# EAGLE design rev_4 (EAGLE 5.10)

## Sheet 1 of 2
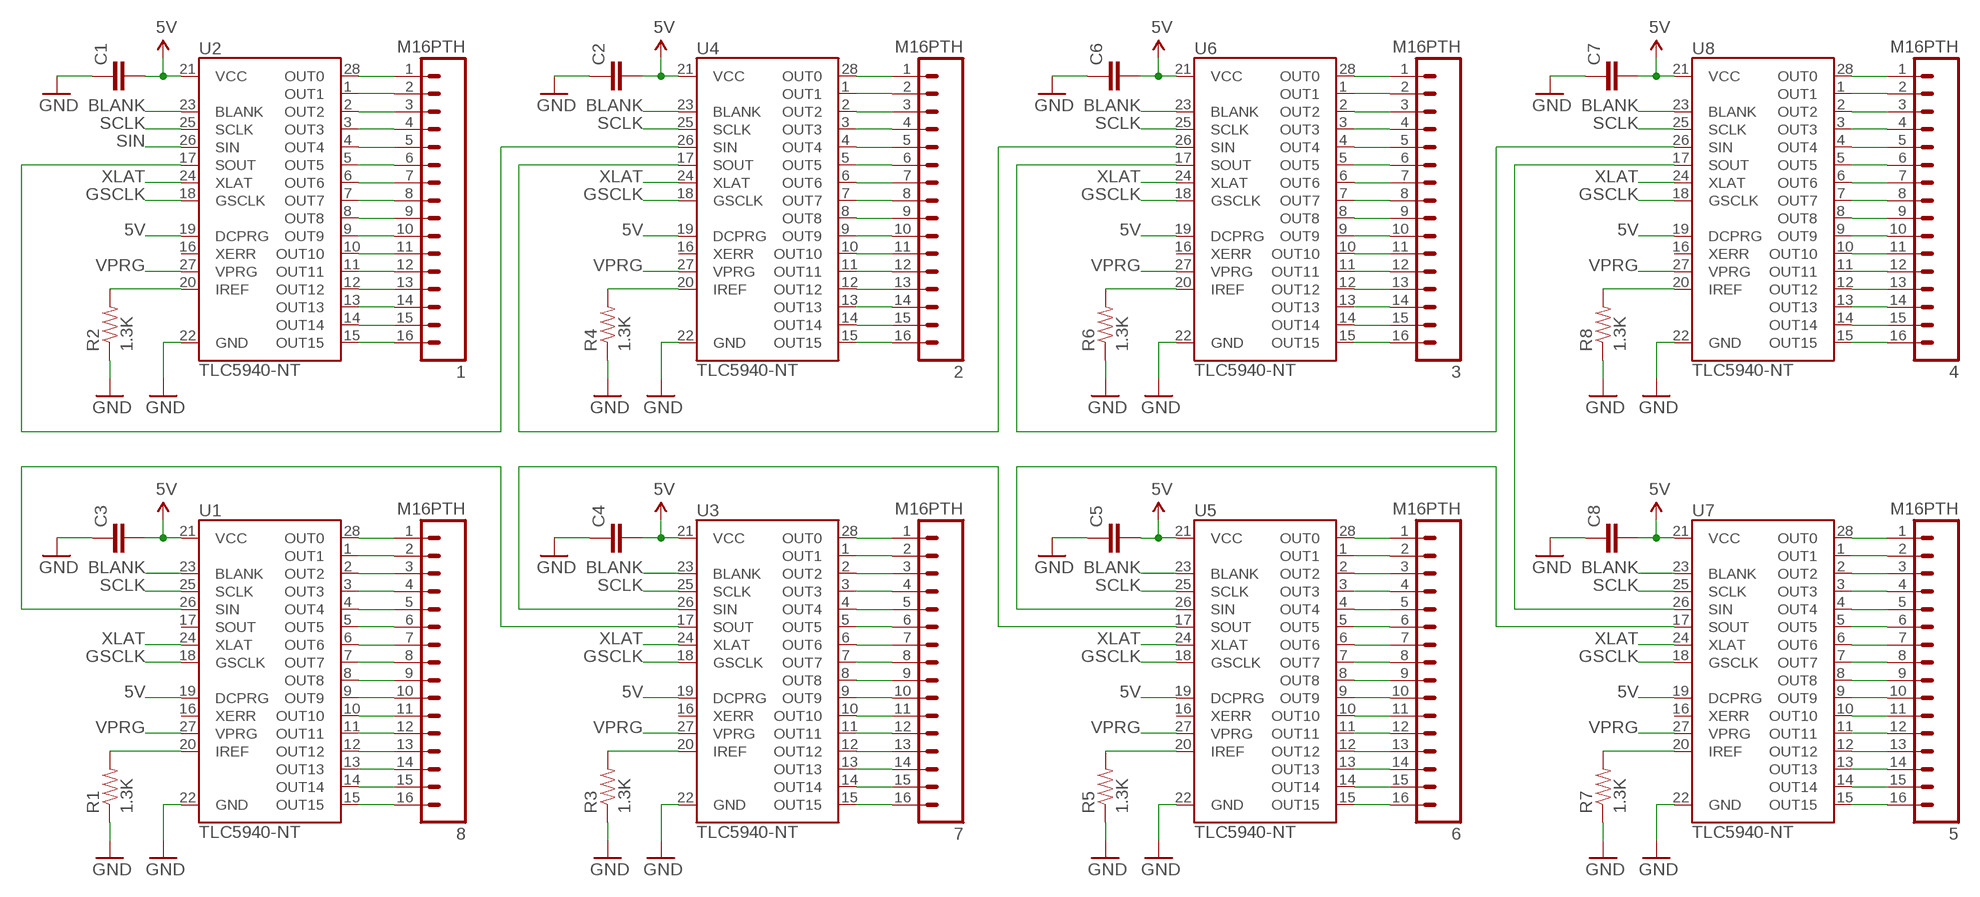
[diagram p0: schematic, sheet 1]

### Parts
1  M16PTH  [1X16]
2  M16PTH  [1X16]
3  M16PTH  [1X16]
4  M16PTH  [1X16]
5  M16PTH  [1X16]
6  M16PTH  [1X16]
7  M16PTH  [1X16]
8  M16PTH  [1X16]
C1  CAPPTH  [CAP-PTH-SMALL]
C2  CAPPTH  [CAP-PTH-SMALL]
C3  CAPPTH  [CAP-PTH-SMALL]
C4  CAPPTH  [CAP-PTH-SMALL]
C5  CAPPTH  [CAP-PTH-SMALL]
C6  CAPPTH  [CAP-PTH-SMALL]
C7  CAPPTH  [CAP-PTH-SMALL]
C8  CAPPTH  [CAP-PTH-SMALL]
R1  1.3K  RESISTORPTH-1/6W  [1/6W-RES]
R2  1.3K  RESISTORPTH-1/6W  [1/6W-RES]
R3  1.3K  RESISTORPTH-1/6W  [1/6W-RES]
R4  1.3K  RESISTORPTH-1/6W  [1/6W-RES]
R5  1.3K  RESISTORPTH-1/6W  [1/6W-RES]
R6  1.3K  RESISTORPTH-1/6W  [1/6W-RES]
R7  1.3K  RESISTORPTH-1/6W  [1/6W-RES]
R8  1.3K  RESISTORPTH-1/6W  [1/6W-RES]
U1  TLC5940-NT  [DIL28-3]
U2  TLC5940-NT  [DIL28-3]
U3  TLC5940-NT  [DIL28-3]
U4  TLC5940-NT  [DIL28-3]
U5  TLC5940-NT  [DIL28-3]
U6  TLC5940-NT  [DIL28-3]
U7  TLC5940-NT  [DIL28-3]
U8  TLC5940-NT  [DIL28-3]

### Nets
5V: C1.2 C2.2 C3.2 C4.2 C5.2 C6.2 C7.2 C8.2 U1.19(DCPRG) U1.21(VCC) U2.19(DCPRG) U2.21(VCC) U3.19(DCPRG) U3.21(VCC) U4.19(DCPRG) U4.21(VCC) U5.19(DCPRG) U5.21(VCC) U6.19(DCPRG) U6.21(VCC) U7.19(DCPRG) U7.21(VCC) U8.19(DCPRG) U8.21(VCC)
BLANK: U1.23(BLANK) U2.23(BLANK) U3.23(BLANK) U4.23(BLANK) U5.23(BLANK) U6.23(BLANK) U7.23(BLANK) U8.23(BLANK)
GND: C1.1 C2.1 C3.1 C4.1 C5.1 C6.1 C7.1 C8.1 R1.1 R2.1 R3.1 R4.1 R5.1 R6.1 R7.1 R8.1 U1.22(GND) U2.22(GND) U3.22(GND) U4.22(GND) U5.22(GND) U6.22(GND) U7.22(GND) U8.22(GND)
GSCLK: U1.18(GSCLK) U2.18(GSCLK) U3.18(GSCLK) U4.18(GSCLK) U5.18(GSCLK) U6.18(GSCLK) U7.18(GSCLK) U8.18(GSCLK)
N$1: 8.1 U1.28(OUT0)
N$2: 8.2 U1.1(OUT1)
N$3: 8.3 U1.2(OUT2)
N$4: 8.4 U1.3(OUT3)
N$5: 8.5 U1.4(OUT4)
N$6: 8.6 U1.5(OUT5)
N$7: 8.7 U1.6(OUT6)
N$8: 8.8 U1.7(OUT7)
N$9: 8.9 U1.8(OUT8)
N$10: 8.10 U1.9(OUT9)
N$11: 8.11 U1.10(OUT10)
N$12: 8.12 U1.11(OUT11)
N$13: 8.13 U1.12(OUT12)
N$14: 8.14 U1.13(OUT13)
N$15: 8.15 U1.14(OUT14)
N$16: 8.16 U1.15(OUT15)
N$17: R1.2 U1.20(IREF)
N$18: R2.2 U2.20(IREF)
N$19: 1.1 U2.28(OUT0)
N$20: 1.2 U2.1(OUT1)
N$23: 1.3 U2.2(OUT2)
N$24: 1.4 U2.3(OUT3)
N$25: 1.5 U2.4(OUT4)
N$26: 1.6 U2.5(OUT5)
N$27: 1.7 U2.6(OUT6)
N$28: 1.8 U2.7(OUT7)
N$29: 1.9 U2.8(OUT8)
N$30: 1.10 U2.9(OUT9)
N$31: 1.11 U2.10(OUT10)
N$32: 1.12 U2.11(OUT11)
N$33: 1.13 U2.12(OUT12)
N$34: 1.14 U2.13(OUT13)
N$35: 1.15 U2.14(OUT14)
N$36: 1.16 U2.15(OUT15)
N$37: U2.17(SOUT) U4.26(SIN)
N$39: R3.2 U3.20(IREF)
N$40: 7.1 U3.28(OUT0)
N$41: 7.2 U3.1(OUT1)
N$42: 7.3 U3.2(OUT2)
N$43: 7.4 U3.3(OUT3)
N$44: 7.5 U3.4(OUT4)
N$45: 7.6 U3.5(OUT5)
N$46: 7.7 U3.6(OUT6)
N$47: 7.8 U3.7(OUT7)
N$48: 7.9 U3.8(OUT8)
N$49: 7.10 U3.9(OUT9)
N$50: 7.11 U3.10(OUT10)
N$51: 7.12 U3.11(OUT11)
N$52: 7.13 U3.12(OUT12)
N$53: 7.14 U3.13(OUT13)
N$54: 7.15 U3.14(OUT14)
N$55: 7.16 U3.15(OUT15)
N$56: U1.26(SIN) U3.17(SOUT)
N$58: R4.2 U4.20(IREF)
N$59: 2.1 U4.28(OUT0)
N$60: 2.2 U4.1(OUT1)
N$61: 2.3 U4.2(OUT2)
N$62: 2.4 U4.3(OUT3)
N$63: 2.5 U4.4(OUT4)
N$64: 2.6 U4.5(OUT5)
N$65: 2.7 U4.6(OUT6)
N$66: 2.8 U4.7(OUT7)
N$67: 2.9 U4.8(OUT8)
N$68: 2.10 U4.9(OUT9)
N$69: 2.11 U4.10(OUT10)
N$70: 2.12 U4.11(OUT11)
N$71: 2.13 U4.12(OUT12)
N$72: 2.14 U4.13(OUT13)
N$73: 2.15 U4.14(OUT14)
N$74: 2.16 U4.15(OUT15)
N$75: U4.17(SOUT) U6.26(SIN)
N$77: R5.2 U5.20(IREF)
N$78: 6.1 U5.28(OUT0)
N$79: 6.2 U5.1(OUT1)
N$80: 6.3 U5.2(OUT2)
N$81: 6.4 U5.3(OUT3)
N$82: 6.5 U5.4(OUT4)
N$83: 6.6 U5.5(OUT5)
N$84: 6.7 U5.6(OUT6)
N$85: 6.8 U5.7(OUT7)
N$86: 6.9 U5.8(OUT8)
N$87: 6.10 U5.9(OUT9)
N$88: 6.11 U5.10(OUT10)
N$89: 6.12 U5.11(OUT11)
N$90: 6.13 U5.12(OUT12)
N$91: 6.14 U5.13(OUT13)
N$92: 6.15 U5.14(OUT14)
N$93: 6.16 U5.15(OUT15)
N$94: U3.26(SIN) U5.17(SOUT)
N$96: R6.2 U6.20(IREF)
N$97: 3.1 U6.28(OUT0)
N$98: 3.2 U6.1(OUT1)
N$99: 3.3 U6.2(OUT2)
N$100: 3.4 U6.3(OUT3)
N$101: 3.5 U6.4(OUT4)
N$102: 3.6 U6.5(OUT5)
N$103: 3.7 U6.6(OUT6)
N$104: 3.8 U6.7(OUT7)
N$105: 3.9 U6.8(OUT8)
N$106: 3.10 U6.9(OUT9)
N$107: 3.11 U6.10(OUT10)
N$108: 3.12 U6.11(OUT11)
N$109: 3.13 U6.12(OUT12)
N$110: 3.14 U6.13(OUT13)
N$111: 3.15 U6.14(OUT14)
N$112: 3.16 U6.15(OUT15)
N$113: U6.17(SOUT) U8.26(SIN)
N$115: R7.2 U7.20(IREF)
N$116: 5.1 U7.28(OUT0)
N$117: 5.2 U7.1(OUT1)
N$118: 5.3 U7.2(OUT2)
N$119: 5.4 U7.3(OUT3)
N$120: 5.5 U7.4(OUT4)
N$121: 5.6 U7.5(OUT5)
N$122: 5.7 U7.6(OUT6)
N$123: 5.8 U7.7(OUT7)
N$124: 5.9 U7.8(OUT8)
N$125: 5.10 U7.9(OUT9)
N$126: 5.11 U7.10(OUT10)
N$127: 5.12 U7.11(OUT11)
N$128: 5.13 U7.12(OUT12)
N$129: 5.14 U7.13(OUT13)
N$130: 5.15 U7.14(OUT14)
N$131: 5.16 U7.15(OUT15)
N$132: U5.26(SIN) U7.17(SOUT)
N$134: R8.2 U8.20(IREF)
N$135: 4.1 U8.28(OUT0)
N$136: 4.2 U8.1(OUT1)
N$137: 4.3 U8.2(OUT2)
N$138: 4.4 U8.3(OUT3)
N$139: 4.5 U8.4(OUT4)
N$140: 4.6 U8.5(OUT5)
N$141: 4.7 U8.6(OUT6)
N$142: 4.8 U8.7(OUT7)
N$143: 4.9 U8.8(OUT8)
N$144: 4.10 U8.9(OUT9)
N$145: 4.11 U8.10(OUT10)
N$146: 4.12 U8.11(OUT11)
N$147: 4.13 U8.12(OUT12)
N$148: 4.14 U8.13(OUT13)
N$149: 4.15 U8.14(OUT14)
N$150: 4.16 U8.15(OUT15)
N$151: U7.26(SIN) U8.17(SOUT)
SCLK: U1.25(SCLK) U2.25(SCLK) U3.25(SCLK) U4.25(SCLK) U5.25(SCLK) U6.25(SCLK) U7.25(SCLK) U8.25(SCLK)
SIN: U2.26(SIN)
VPRG: U1.27(VPRG) U2.27(VPRG) U3.27(VPRG) U4.27(VPRG) U5.27(VPRG) U6.27(VPRG) U7.27(VPRG) U8.27(VPRG)
XLAT: U1.24(XLAT) U2.24(XLAT) U3.24(XLAT) U4.24(XLAT) U5.24(XLAT) U6.24(XLAT) U7.24(XLAT) U8.24(XLAT)
Unconnected: U1.16(XERR) U1.17(SOUT) U2.16(XERR) U3.16(XERR) U4.16(XERR) U5.16(XERR) U6.16(XERR) U7.16(XERR) U8.16(XERR)

## Sheet 2 of 2
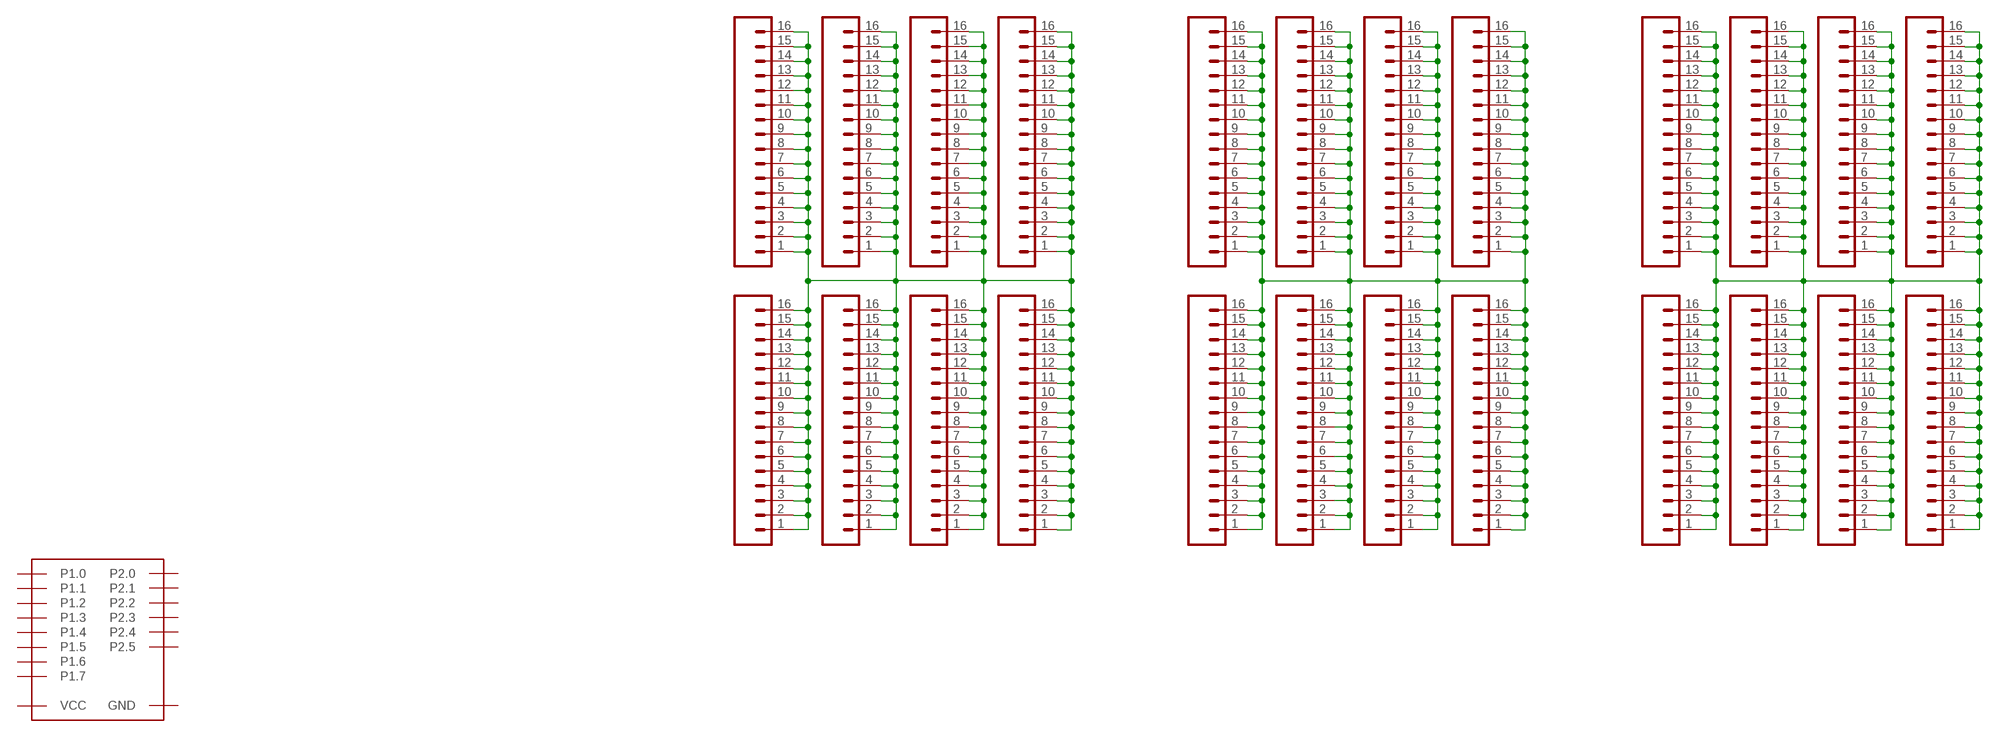
[diagram p1: schematic, sheet 2]

### Parts
JP1  M16PTH  [1X16]
JP2  M16PTH  [1X16]
JP3  M16PTH  [1X16]
JP4  M16PTH  [1X16]
JP5  M16PTH  [1X16]
JP6  M16PTH  [1X16]
JP7  M16PTH  [1X16]
JP8  M16PTH  [1X16]
JP9  M16PTH  [1X16]
JP10  M16PTH  [1X16]
JP11  M16PTH  [1X16]
JP12  M16PTH  [1X16]
JP13  M16PTH  [1X16]
JP14  M16PTH  [1X16]
JP15  M16PTH  [1X16]
JP16  M16PTH  [1X16]
JP17  M16PTH  [1X16]
JP18  M16PTH  [1X16]
JP19  M16PTH  [1X16]
JP20  M16PTH  [1X16]
JP21  M16PTH  [1X16]
JP22  M16PTH  [1X16]
JP23  M16PTH  [1X16]
JP24  M16PTH  [1X16]
U$9  TI_LAUNCHPAD  [TI_LAUNCHPAD]

### Nets
N$21: JP2.1 JP2.2 JP2.3 JP2.4 JP2.5 JP2.6 JP2.7 JP2.8 JP2.9 JP2.10 JP2.11 JP2.12 JP2.13 JP2.14 JP2.15 JP2.16 JP5.1 JP5.2 JP5.3 JP5.4 JP5.5 JP5.6 JP5.7 JP5.8 JP5.9 JP5.10 JP5.11 JP5.12 JP5.13 JP5.14 JP5.15 JP5.16 JP8.1 JP8.2 JP8.3 JP8.4 JP8.5 JP8.6 JP8.7 JP8.8 JP8.9 JP8.10 JP8.11 JP8.12 JP8.13 JP8.14 JP8.15 JP8.16 JP11.1 JP11.2 JP11.3 JP11.4 JP11.5 JP11.6 JP11.7 JP11.8 JP11.9 JP11.10 JP11.11 JP11.12 JP11.13 JP11.14 JP11.15 JP11.16 JP14.1 JP14.2 JP14.3 JP14.4 JP14.5 JP14.6 JP14.7 JP14.8 JP14.9 JP14.10 JP14.11 JP14.12 JP14.13 JP14.14 JP14.15 JP14.16 JP17.1 JP17.2 JP17.3 JP17.4 JP17.5 JP17.6 JP17.7 JP17.8 JP17.9 JP17.10 JP17.11 JP17.12 JP17.13 JP17.14 JP17.15 JP17.16 JP19.1 JP19.2 JP19.3 JP19.4 JP19.5 JP19.6 JP19.7 JP19.8 JP19.9 JP19.10 JP19.11 JP19.12 JP19.13 JP19.14 JP19.15 JP19.16 JP22.1 JP22.2 JP22.3 JP22.4 JP22.5 JP22.6 JP22.7 JP22.8 JP22.9 JP22.10 JP22.11 JP22.12 JP22.13 JP22.14 JP22.15 JP22.16
N$22: JP1.1 JP1.2 JP1.3 JP1.4 JP1.5 JP1.6 JP1.7 JP1.8 JP1.9 JP1.10 JP1.11 JP1.12 JP1.13 JP1.14 JP1.15 JP1.16 JP4.1 JP4.2 JP4.3 JP4.4 JP4.5 JP4.6 JP4.7 JP4.8 JP4.9 JP4.10 JP4.11 JP4.12 JP4.13 JP4.14 JP4.15 JP4.16 JP7.1 JP7.2 JP7.3 JP7.4 JP7.5 JP7.6 JP7.7 JP7.8 JP7.9 JP7.10 JP7.11 JP7.12 JP7.13 JP7.14 JP7.15 JP7.16 JP10.1 JP10.2 JP10.3 JP10.4 JP10.5 JP10.6 JP10.7 JP10.8 JP10.9 JP10.10 JP10.11 JP10.12 JP10.13 JP10.14 JP10.15 JP10.16 JP13.1 JP13.2 JP13.3 JP13.4 JP13.5 JP13.6 JP13.7 JP13.8 JP13.9 JP13.10 JP13.11 JP13.12 JP13.13 JP13.14 JP13.15 JP13.16 JP16.1 JP16.2 JP16.3 JP16.4 JP16.5 JP16.6 JP16.7 JP16.8 JP16.9 JP16.10 JP16.11 JP16.12 JP16.13 JP16.14 JP16.15 JP16.16 JP20.1 JP20.2 JP20.3 JP20.4 JP20.5 JP20.6 JP20.7 JP20.8 JP20.9 JP20.10 JP20.11 JP20.12 JP20.13 JP20.14 JP20.15 JP20.16 JP23.1 JP23.2 JP23.3 JP23.4 JP23.5 JP23.6 JP23.7 JP23.8 JP23.9 JP23.10 JP23.11 JP23.12 JP23.13 JP23.14 JP23.15 JP23.16
N$76: JP3.1 JP3.2 JP3.3 JP3.4 JP3.5 JP3.6 JP3.7 JP3.8 JP3.9 JP3.10 JP3.11 JP3.12 JP3.13 JP3.14 JP3.15 JP3.16 JP6.1 JP6.2 JP6.3 JP6.4 JP6.5 JP6.6 JP6.7 JP6.8 JP6.9 JP6.10 JP6.11 JP6.12 JP6.13 JP6.14 JP6.15 JP6.16 JP9.1 JP9.2 JP9.3 JP9.4 JP9.5 JP9.6 JP9.7 JP9.8 JP9.9 JP9.10 JP9.11 JP9.12 JP9.13 JP9.14 JP9.15 JP9.16 JP12.1 JP12.2 JP12.3 JP12.4 JP12.5 JP12.6 JP12.7 JP12.8 JP12.9 JP12.10 JP12.11 JP12.12 JP12.13 JP12.14 JP12.15 JP12.16 JP15.1 JP15.2 JP15.3 JP15.4 JP15.5 JP15.6 JP15.7 JP15.8 JP15.9 JP15.10 JP15.11 JP15.12 JP15.13 JP15.14 JP15.15 JP15.16 JP18.1 JP18.2 JP18.3 JP18.4 JP18.5 JP18.6 JP18.7 JP18.8 JP18.9 JP18.10 JP18.11 JP18.12 JP18.13 JP18.14 JP18.15 JP18.16 JP21.1 JP21.2 JP21.3 JP21.4 JP21.5 JP21.6 JP21.7 JP21.8 JP21.9 JP21.10 JP21.11 JP21.12 JP21.13 JP21.14 JP21.15 JP21.16 JP24.1 JP24.2 JP24.3 JP24.4 JP24.5 JP24.6 JP24.7 JP24.8 JP24.9 JP24.10 JP24.11 JP24.12 JP24.13 JP24.14 JP24.15 JP24.16
Unconnected: U$9.GND U$9.P1.0 U$9.P1.1 U$9.P1.2 U$9.P1.3 U$9.P1.4 U$9.P1.5 U$9.P1.6 U$9.P1.7 U$9.P2.0 U$9.P2.1 U$9.P2.2 U$9.P2.3 U$9.P2.4 U$9.P2.5 U$9.VCC

## Library data of the parts
1-8 JP1-JP24 = SparkFun:M16
C1-C8 = SparkFun:CAP: Capacitor Standard 0603 ceramic capacitor, and 0.1" leaded capacitor.
R1-R8 = SparkFun:RESISTOR: Resistor Basic schematic elements and footprints for 0603, 1206, and PTH resistors.
U1-U8 = SparkFun:TLC5940: TI TLC5940 16-channel LED Driver with Dot Correction and Grayscale PWM Control The TLC5940 is a 16-channel, constant-current sink LED driver. Each channel has an individually adjustable 4096-step grayscale PWM brightness control and a 64-step, constant-current sink (dot correction). The dot correction adjusts the brightness variations between LED channels and other LED drivers. The dot correction data is stored in an integrated EEPROM. Both grayscale control and dot correction are accessible via a serial interface. A single external resistor sets the maximum current value of all 16 channels. Packages: 28-pin HTSSOP 32-pin 5x5mm QFN 28-pin DIP
U$9 = launchpad_comp:TI_LAUNCHPAD

## Board
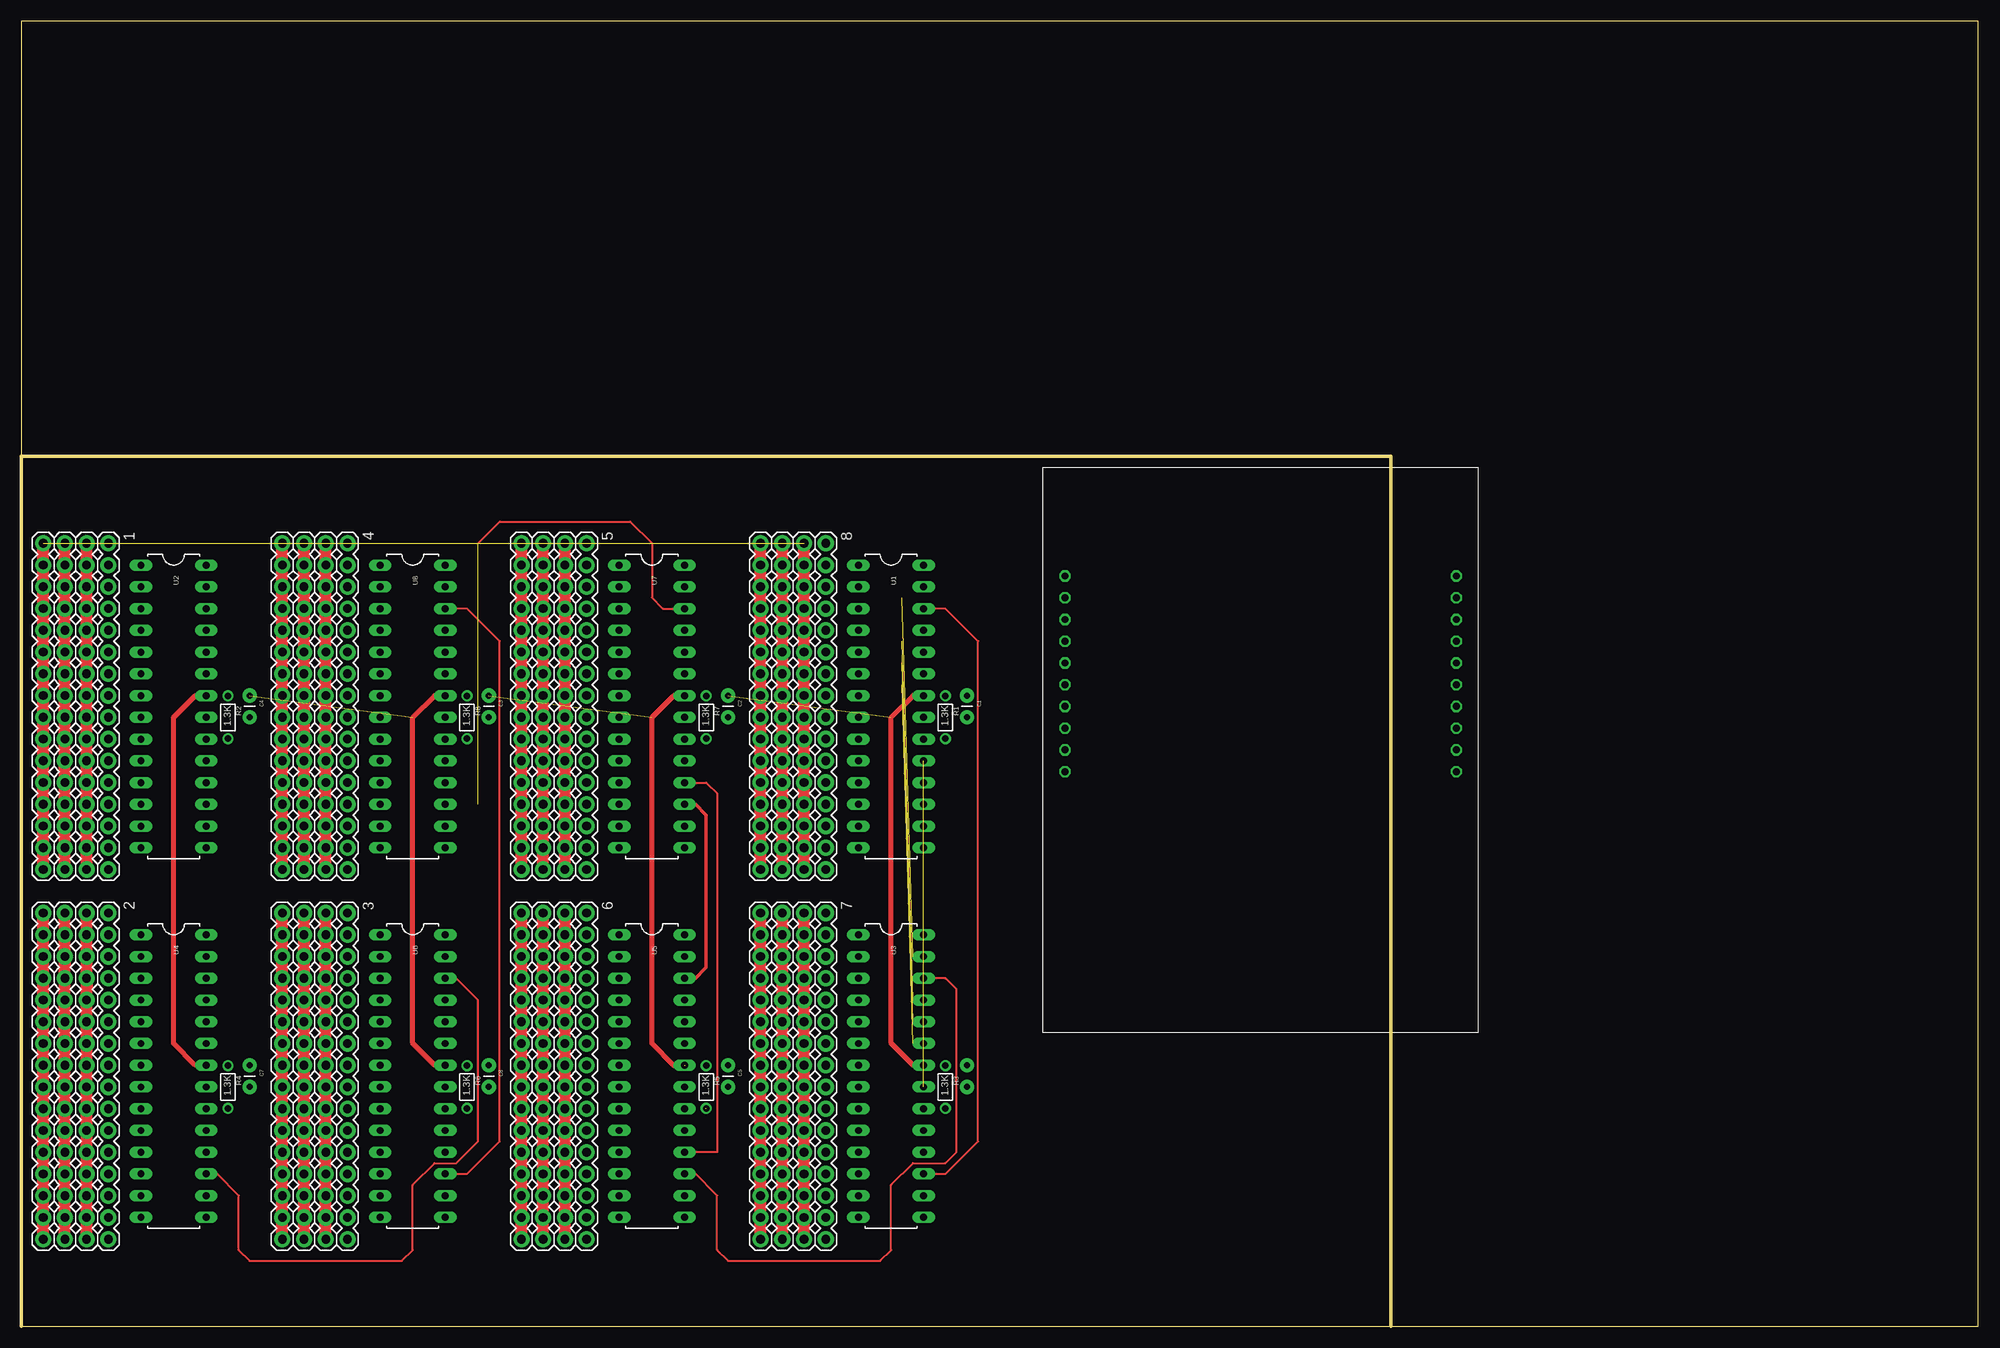
[diagram p2: board, top side]
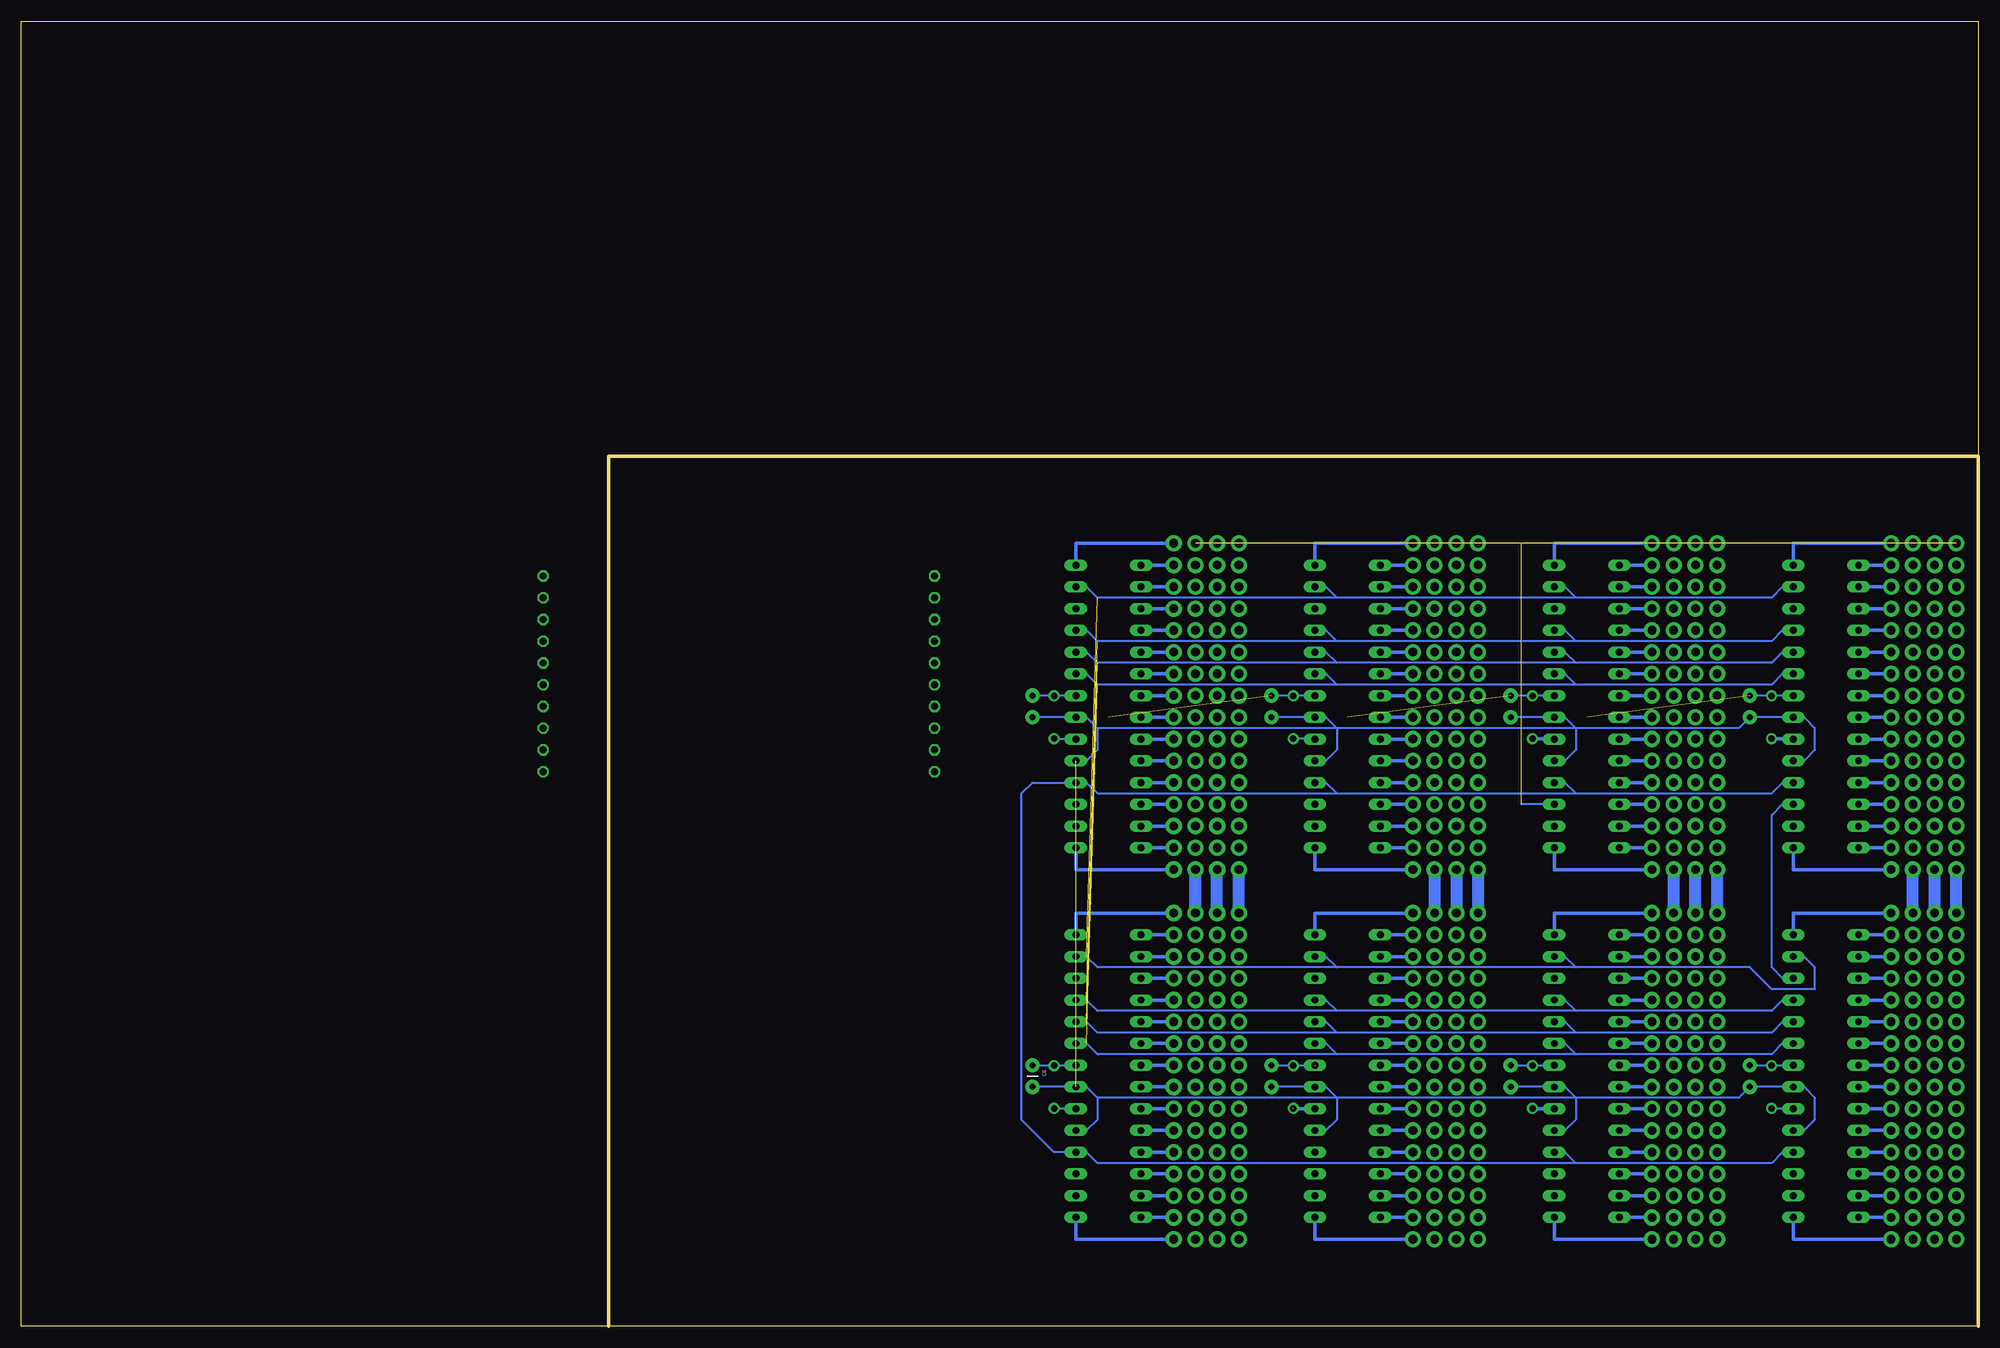
[diagram p3: board, bottom side, seen from below]

Size 228.6 x 152.4 mm. Coordinates in mm from the lower left corner, seen from the top.
Outline: 160.02,0 0,0 0,101.6
Outline: 160.02,0 228.6,0 228.6,152.4 0,152.4 0,101.6
Outline: 0,101.6 160.02,101.6 160.02,0
Copper layers (1*16): Top 0.0356mm / dielectric 1.5011mm / Bottom 0.0356mm
Design rules "SilverCircuits": minimum track width 7mil, minimum drill 14mil, track to track 7mil, track to pad 7mil, pad to pad 7mil, via to via 7mil, smd to smd 0mil, copper to edge 20mil, drill to drill 8mil, minimum pad ring 10mil, minimum via ring 8mil, stop-mask expansion 4mil, vias tented up to drill 0mil, thermal gap 10mil

### Footprints (pad centres in the part's own frame; a part is rotated, then mirrored left to right if it is on the bottom)
1X16 = drill 1.016 pad 1.88 round: 1 0,0; 2 2.54,0; 3 5.08,0; 4 7.62,0; 5 10.16,0; 6 12.7,0; 7 15.24,0; 8 17.78,0; 9 20.32,0; 10 22.86,0; 11 25.4,0; 12 27.94,0; 13 30.48,0; 14 33.02,0; 15 35.56,0; 16 38.1,0
CAP-PTH-SMALL = drill 0.7 pad 1.651 round: 1 0,0; 2 2.54,0
1/6W-RES = drill 0.762 round: 1 -2.5,0; 2 2.5,0
DIL28-3 = drill 0.813 long: 1 -16.51,-3.81; 2 -13.97,-3.81; 3 -11.43,-3.81; 4 -8.89,-3.81; 5 -6.35,-3.81; 6 -3.81,-3.81; 7 -1.27,-3.81; 8 1.27,-3.81; 9 3.81,-3.81; 10 6.35,-3.81; 11 8.89,-3.81; 12 11.43,-3.81; 13 13.97,-3.81; 14 16.51,-3.81; 15 16.51,3.81; 16 13.97,3.81; 17 11.43,3.81; 18 8.89,3.81; 19 6.35,3.81; 20 3.81,3.81; 21 1.27,3.81; 22 -1.27,3.81; 23 -3.81,3.81; 24 -6.35,3.81; 25 -8.89,3.81; 26 -11.43,3.81; 27 -13.97,3.81; 28 -16.51,3.81
TI_LAUNCHPAD = drill 0.8 octagon: GND 48.26,35.56; P1.0 2.54,33.02; P1.1 2.54,30.48; P1.2 2.54,27.94; P1.3 2.54,25.4; P1.4 2.54,22.86; P1.5 2.54,20.32; P1.6 48.26,20.32; P1.7 48.26,22.86; P2.0 2.54,17.78; P2.1 2.54,15.24; P2.2 2.54,12.7; P2.3 48.26,12.7; P2.4 48.26,15.24; P2.5 48.26,17.78; RST 48.26,25.4; TEST 48.26,27.94; VCC 2.54,35.56; XIN 48.26,33.02; XOUT 48.26,30.48

### Placement (x,y rotation side)
1  10.16,91.44 270 top
2  10.16,48.26 270 top
3  38.1,48.26 270 top
4  38.1,91.44 270 top
5  66.04,91.44 270 top
6  66.04,48.26 270 top
7  93.98,48.26 270 top
8  93.98,91.44 270 top
C1  110.49,73.66 270 top
C2  82.55,73.66 270 top
C3  54.61,73.66 270 top
C4  26.67,73.66 270 top
C5  82.55,30.48 270 top
C6  110.49,30.48 270 bottom
C7  26.67,30.48 270 top
C8  54.61,30.48 270 top
JP1  7.62,91.44 270 top
JP2  5.08,91.44 270 top
JP3  2.54,91.44 270 top
JP4  7.62,48.26 270 top
JP5  5.08,48.26 270 top
JP6  2.54,48.26 270 top
JP7  35.56,91.44 270 top
JP8  33.02,91.44 270 top
JP9  30.48,91.44 270 top
JP10  35.56,48.26 270 top
JP11  33.02,48.26 270 top
JP12  30.48,48.26 270 top
JP13  63.5,91.44 270 top
JP14  60.96,91.44 270 top
JP15  86.36,48.26 270 top
JP16  91.44,48.26 270 top
JP17  88.9,48.26 270 top
JP18  86.36,91.44 270 top
JP19  88.9,91.44 270 top
JP20  91.44,91.44 270 top
JP21  58.42,48.26 270 top
JP22  60.96,48.26 270 top
JP23  63.5,48.26 270 top
JP24  58.42,91.44 270 top
R1  107.95,71.12 270 top
R2  24.13,71.12 270 top
R3  107.95,27.94 270 top
R4  24.13,27.94 270 top
R5  80.01,27.94 270 top
R6  52.07,27.94 270 top
R7  80.01,71.12 270 top
R8  52.07,71.12 270 top
U1  101.6,72.39 270 top
U2  17.78,72.39 270 top
U3  101.6,29.21 270 top
U4  17.78,29.21 270 top
U5  73.66,29.21 270 top
U6  45.72,29.21 270 top
U7  73.66,72.39 270 top
U8  45.72,72.39 270 top
U$9  170.18,100.33 180 top

### Tracks (layer width: path | path; a pad name or v marks a point on that pad's centre or on a via)
5V  (1 unrouted)
  Bottom 0.254: 46.99,69.85 74.93,69.85 | 74.93,69.85 102.87,69.85 | 102.87,69.85 104.14,71.12 U1.21 C1.2 | 74.93,69.85 76.2,71.12 U7.21 C2.2 | 46.99,69.85 48.26,71.12 U8.21 C3.2 | 46.99,26.67 74.93,26.67 | 74.93,26.67 102.87,26.67 | 102.87,26.67 104.14,27.94 U3.21 C6.2 | 74.93,26.67 76.2,27.94 U5.21 C5.2 | 46.99,26.67 48.26,27.94 U6.21 C8.2 | U6.19 48.26,22.86 46.99,24.13 46.99,26.67 | U5.19 76.2,22.86 74.93,24.13 74.93,26.67 | U3.19 104.14,22.86 102.87,24.13 102.87,26.67 | U1.19 104.14,66.04 102.87,67.31 102.87,69.85 | U7.19 76.2,66.04 74.93,67.31 74.93,69.85 | U8.19 48.26,66.04 46.99,67.31 46.99,69.85 | U2.19 20.32,66.04 19.05,67.31 19.05,69.85 20.32,71.12 U2.21 C4.2 27.94,69.85 46.99,69.85 | 46.99,26.67 27.94,26.67 C7.2 U4.21 20.32,27.94 19.05,26.67 19.05,24.13 20.32,22.86 U4.19
BLANK  (1 unrouted)
  Bottom 0.254: U2.23 22.86,76.2 24.13,74.93 46.99,74.93 | 46.99,74.93 74.93,74.93 | 74.93,74.93 102.87,74.93 104.14,76.2 U1.23 | U7.23 76.2,76.2 74.93,74.93 | U8.23 48.26,76.2 46.99,74.93 | U4.23 22.86,33.02 24.13,31.75 46.99,31.75 | 46.99,31.75 74.93,31.75 | 74.93,31.75 102.87,31.75 104.14,33.02 U3.23 | U5.23 76.2,33.02 74.93,31.75 | U6.23 48.26,33.02 46.99,31.75
GND  (4 unrouted)
  Top 0.61: U4.22 20.32,30.48 17.78,33.02 17.78,71.12 20.32,73.66 U2.22 | U6.22 48.26,30.48 45.72,33.02 45.72,71.12 48.26,73.66 U8.22 | U3.22 104.14,30.48 101.6,33.02 101.6,71.12 104.14,73.66 U1.22 | 77.47,30.44 76.24,30.44 73.66,33.02 73.66,71.12 76.2,73.66 U7.22
  Bottom 0.254: U4.22 21.63,30.44 R4.1 26.63,30.44 C7.1 | U2.22 21.63,73.62 R2.1 26.63,73.62 C4.1 | U8.22 49.57,73.62 R8.1 54.57,73.62 C3.1 | U6.22 49.57,30.44 R6.1 54.57,30.44 C8.1 | U5.22 77.51,30.44 R5.1 82.51,30.44 C5.1 | U7.22 77.51,73.62 R7.1 82.51,73.62 C2.1 | U1.22 105.45,73.62 R1.1 110.45,73.62 C1.1 | U3.22 105.45,30.44 R3.1 110.45,30.44 C6.1
  Bottom 0.406: U2.22 21.59,73.62
GSCLK
  Top 0.254: U5.18 81.28,20.32 81.28,62.23 80.01,63.5 U7.18
  Bottom 0.254: U2.18 22.86,63.5 24.13,62.23 46.99,62.23 | 74.93,62.23 46.99,62.23 | U8.18 48.26,63.5 46.99,62.23 | U4.18 22.86,20.32 24.13,19.05 46.99,19.05 | 46.99,19.05 102.87,19.05 104.14,20.32 U3.18 107.95,20.32 111.76,24.13 111.76,62.23 110.49,63.5 U1.18 104.14,63.5 102.87,62.23 74.93,62.23 | U6.18 48.26,20.32 46.99,19.05 | 74.93,62.23 76.2,63.5 U7.18
N$1
  Bottom 0.406: U1.28 105.41,91.44 8.1
N$2
  Bottom 0.406: 8.2 U1.1
N$3
  Bottom 0.406: 8.3 U1.2
N$4
  Bottom 0.406: 8.4 U1.3
N$5
  Bottom 0.406: 8.5 U1.4
N$6
  Bottom 0.406: 8.6 U1.5
N$7
  Bottom 0.406: 8.7 U1.6
N$8
  Bottom 0.406: 8.8 U1.7
N$9
  Bottom 0.406: 8.9 U1.8
N$10
  Bottom 0.406: 8.10 U1.9
N$11
  Bottom 0.406: 8.11 U1.10
N$12
  Bottom 0.406: 8.12 U1.11
N$13
  Bottom 0.406: 8.13 U1.12
N$14
  Bottom 0.406: 8.14 U1.13
N$15
  Bottom 0.406: 8.15 U1.14
N$16
  Bottom 0.406: U1.15 105.41,53.34 8.16
N$17
  Bottom 0.254: U1.20 107.91,68.58 R1.2
N$18
  Bottom 0.406: U2.20 21.59,68.62 R2.2
N$19
  Bottom 0.406: U2.28 21.59,91.44 1.1
N$20
  Bottom 0.406: 1.2 U2.1
N$21  (3 unrouted)
  Top 1.422: JP2.1 JP2.2 JP2.3 JP2.4 JP2.5 JP2.6 JP2.7 JP2.8 JP2.9 JP2.10 JP2.11 JP2.12 JP2.13 JP2.14 JP2.15 JP2.16 | JP5.1 JP5.2 JP5.3 | JP5.3 5.08,41.91 | JP5.3 JP5.4 JP5.5 JP5.6 JP5.7 JP5.8 JP5.9 JP5.10 JP5.11 JP5.12 JP5.13 JP5.14 JP5.15 JP5.16 | JP8.1 JP8.2 JP8.3 JP8.4 JP8.5 JP8.6 JP8.7 JP8.8 | JP8.8 33.02,72.39 | JP8.8 JP8.9 JP8.10 JP8.11 JP8.12 JP8.13 JP8.14 JP8.15 JP8.16 | JP11.1 JP11.2 JP11.3 JP11.4 JP11.5 JP11.6 JP11.7 JP11.8 JP11.9 JP11.10 JP11.11 JP11.12 JP11.13 JP11.14 JP11.15 JP11.16 | JP22.16 JP22.15 JP22.14 JP22.13 JP22.12 JP22.11 JP22.10 JP22.9 JP22.8 JP22.7 JP22.6 JP22.5 JP22.4 JP22.3 JP22.2 JP22.1 | JP14.16 JP14.15 JP14.14 JP14.13 JP14.12 JP14.11 JP14.10 JP14.9 JP14.8 JP14.7 JP14.6 JP14.5 JP14.4 JP14.3 JP14.2 JP14.1 | JP19.1 JP19.2 JP19.3 JP19.4 JP19.5 JP19.6 JP19.7 JP19.8 JP19.9 JP19.10 JP19.11 JP19.12 JP19.13 JP19.14 JP19.15 JP19.16 | JP17.1 JP17.2 JP17.3 JP17.4 JP17.5 JP17.6 JP17.7 JP17.8 JP17.9 JP17.10 JP17.11 JP17.12 JP17.13 JP17.14 JP17.15 JP17.16
  Bottom 1.422: JP5.1 JP2.16 | JP11.1 JP8.16 | JP17.1 JP19.16 | JP14.16 JP22.1
N$22  (3 unrouted)
  Top 1.422: JP1.1 JP1.2 JP1.3 JP1.4 JP1.5 JP1.6 JP1.7 JP1.8 JP1.9 JP1.10 JP1.11 JP1.12 JP1.13 JP1.14 JP1.15 JP1.16 | JP4.1 JP4.2 JP4.3 JP4.4 | JP4.4 7.62,39.37 | JP4.4 JP4.5 JP4.6 JP4.7 JP4.8 JP4.9 JP4.10 JP4.11 JP4.12 JP4.13 JP4.14 JP4.15 JP4.16 | JP10.16 JP10.15 JP10.14 JP10.13 JP10.12 JP10.11 JP10.10 JP10.9 JP10.8 JP10.7 JP10.6 JP10.5 JP10.4 JP10.3 JP10.2 JP10.1 | JP7.16 JP7.15 JP7.14 JP7.13 JP7.12 JP7.11 JP7.10 JP7.9 JP7.8 JP7.7 JP7.6 JP7.5 JP7.4 JP7.3 JP7.2 JP7.1 | JP13.1 JP13.2 JP13.3 JP13.4 JP13.5 JP13.6 JP13.7 JP13.8 JP13.9 JP13.10 JP13.11 JP13.12 JP13.13 JP13.14 JP13.15 JP13.16 | JP23.1 JP23.2 JP23.3 JP23.4 JP23.5 JP23.6 JP23.7 JP23.8 JP23.9 JP23.10 JP23.11 JP23.12 JP23.13 JP23.14 JP23.15 JP23.16 | JP16.16 JP16.15 JP16.14 JP16.13 JP16.12 JP16.11 JP16.10 JP16.9 JP16.8 JP16.7 JP16.6 JP16.5 JP16.4 JP16.3 JP16.2 JP16.1 | JP20.16 JP20.15 JP20.14 JP20.13 JP20.12 JP20.11 JP20.10 JP20.9 JP20.8 JP20.7 JP20.6 JP20.5 JP20.4 JP20.3 JP20.2 JP20.1
  Bottom 1.422: JP4.1 JP1.16 | JP10.1 JP7.16 | JP16.1 JP20.16 | JP13.16 JP23.1
N$23
  Bottom 0.406: 1.3 U2.2
N$24
  Bottom 0.406: 1.4 U2.3
N$25
  Bottom 0.406: 1.5 U2.4
N$26
  Bottom 0.406: 1.6 U2.5
N$27
  Bottom 0.406: 1.7 U2.6
N$28
  Bottom 0.406: 1.8 U2.7
N$29
  Bottom 0.406: 1.9 U2.8
N$30
  Bottom 0.406: 1.10 U2.9
N$31
  Bottom 0.406: 1.11 U2.10
N$32
  Bottom 0.406: 1.12 U2.11
N$33
  Bottom 0.406: 1.13 U2.12
N$34
  Bottom 0.406: 1.14 U2.13
N$35
  Bottom 0.406: 1.15 U2.14
N$36
  Bottom 0.406: U2.15 21.59,53.34 1.16
N$37
  Bottom 0.254: U2.17 22.86,60.96 24.13,59.69 24.13,41.91 22.86,40.64 U4.26
N$39
  Bottom 0.254: U3.20 107.91,25.4 R3.2
N$40
  Bottom 0.406: U3.28 105.41,48.26 7.1
N$41
  Bottom 0.406: 7.2 U3.1
N$42
  Bottom 0.406: 7.3 U3.2
N$43
  Bottom 0.406: 7.4 U3.3
N$44
  Bottom 0.406: 7.5 U3.4
N$45
  Bottom 0.406: 7.6 U3.5
N$46
  Bottom 0.406: 7.7 U3.6
N$47
  Bottom 0.406: 7.8 U3.7
N$48
  Bottom 0.406: 7.9 U3.8
N$49
  Bottom 0.406: 7.10 U3.9
N$50
  Bottom 0.406: 7.11 U3.10
N$51
  Bottom 0.406: 7.12 U3.11
N$52
  Bottom 0.406: 7.13 U3.12
N$53
  Bottom 0.406: 7.14 U3.13
N$54
  Bottom 0.406: 7.15 U3.14
N$55
  Bottom 0.406: U3.15 105.41,10.16 7.16
N$56
  Top 0.254: U3.17 107.95,17.78 111.76,21.59 111.76,80.01 107.95,83.82 U1.26
N$58
  Bottom 0.254: U4.20 24.09,25.4 R4.2
N$59
  Bottom 0.406: U4.28 21.59,48.26 2.1
N$60
  Bottom 0.406: 2.2 U4.1
N$61
  Bottom 0.406: 2.3 U4.2
N$62
  Bottom 0.406: 2.4 U4.3
N$63
  Bottom 0.406: 2.5 U4.4
N$64
  Bottom 0.406: 2.6 U4.5
N$65
  Bottom 0.406: 2.7 U4.6
N$66
  Bottom 0.406: 2.8 U4.7
N$67
  Bottom 0.406: 2.9 U4.8
N$68
  Bottom 0.406: 2.10 U4.9
N$69
  Bottom 0.406: 2.11 U4.10
N$70
  Bottom 0.406: 2.12 U4.11
N$71
  Bottom 0.406: 2.13 U4.12
N$72
  Bottom 0.406: 2.14 U4.13
N$73
  Bottom 0.406: 2.15 U4.14
N$74
  Bottom 0.406: U4.15 21.59,10.16 2.16
N$75
  Top 0.254: U6.26 50.8,40.64 53.34,38.1 53.34,21.59 50.8,19.05 48.26,19.05 45.72,16.51 45.72,8.89 44.45,7.62 26.67,7.62 25.4,8.89 25.4,15.24 22.86,17.78 U4.17
N$76  (3 unrouted)
  Top 1.422: JP3.1 JP3.2 JP3.3 JP3.4 JP3.5 JP3.6 JP3.7 JP3.8 JP3.9 JP3.10 JP3.11 JP3.12 JP3.13 JP3.14 JP3.15 JP3.16 | JP6.1 JP6.2 JP6.3 JP6.4 JP6.5 JP6.6 JP6.7 JP6.8 JP6.9 | JP6.9 2.54,26.67 | JP6.9 JP6.10 JP6.11 JP6.12 JP6.13 JP6.14 JP6.15 JP6.16 | JP12.16 JP12.15 JP12.14 JP12.13 JP12.12 JP12.11 JP12.10 JP12.9 JP12.8 JP12.7 JP12.6 JP12.5 JP12.4 JP12.3 JP12.2 JP12.1 | JP9.16 JP9.15 JP9.14 JP9.13 JP9.12 JP9.11 JP9.10 JP9.9 JP9.8 JP9.7 JP9.6 JP9.5 JP9.4 JP9.3 JP9.2 JP9.1 | JP24.1 JP24.2 JP24.3 JP24.4 JP24.5 JP24.6 JP24.7 JP24.8 JP24.9 JP24.10 JP24.11 JP24.12 JP24.13 JP24.14 JP24.15 JP24.16 | JP21.1 JP21.2 JP21.3 JP21.4 JP21.5 JP21.6 JP21.7 JP21.8 JP21.9 JP21.10 JP21.11 JP21.12 JP21.13 JP21.14 JP21.15 JP21.16 | JP18.1 JP18.2 JP18.3 JP18.4 JP18.5 JP18.6 JP18.7 JP18.8 JP18.9 JP18.10 JP18.11 | JP18.11 86.36,64.77 | JP18.11 JP18.12 JP18.13 JP18.14 JP18.15 JP18.16 | JP15.1 JP15.2 JP15.3 JP15.4 JP15.5 JP15.6 JP15.7 JP15.8 JP15.9 JP15.10 JP15.11 JP15.12 JP15.13 JP15.14 JP15.15 JP15.16
  Bottom 1.422: JP6.1 JP3.16 | JP12.1 JP9.16 | JP15.1 JP18.16 | JP24.16 JP21.1
N$77  (1 unrouted)
  Bottom 0.406: U5.20 80.01,25.4
N$78
  Bottom 0.406: U5.28 77.47,48.26 6.1
N$79
  Bottom 0.406: 6.2 U5.1
N$80
  Bottom 0.406: 6.3 U5.2
N$81
  Bottom 0.406: 6.4 U5.3
N$82
  Bottom 0.406: 6.5 U5.4
N$83
  Bottom 0.406: 6.6 U5.5
N$84
  Bottom 0.406: 6.7 U5.6
N$85
  Bottom 0.406: 6.8 U5.7
N$86
  Bottom 0.406: 6.9 U5.8
N$87
  Bottom 0.406: 6.10 U5.9
N$88
  Bottom 0.406: 6.11 U5.10
N$89
  Bottom 0.406: 6.12 U5.11
N$90
  Bottom 0.406: 6.13 U5.12
N$91
  Bottom 0.406: 6.14 U5.13
N$92
  Bottom 0.406: 6.15 U5.14
N$93
  Bottom 0.406: U5.15 77.47,10.16 6.16
N$94
  Top 0.254: U5.17 78.74,17.78 81.28,15.24 81.28,8.89 82.55,7.62 100.33,7.62 101.6,8.89 101.6,16.51 104.14,19.05 107.95,19.05 109.22,20.32 109.22,39.37 107.95,40.64 U3.26
N$96
  Bottom 0.406: R6.2 52.07,25.4 U6.20
N$97
  Bottom 0.406: U6.28 49.53,48.26 3.1
N$98
  Bottom 0.406: 3.2 U6.1
N$99
  Bottom 0.406: 3.3 U6.2
N$100
  Bottom 0.406: 3.4 U6.3
N$101
  Bottom 0.406: 3.5 U6.4
N$102
  Bottom 0.406: 3.6 U6.5
N$103
  Bottom 0.406: 3.7 U6.6
N$104
  Bottom 0.406: 3.8 U6.7
N$105
  Bottom 0.406: 3.9 U6.8
N$106
  Bottom 0.406: 3.10 U6.9
N$107
  Bottom 0.406: 3.11 U6.10
N$108
  Bottom 0.406: 3.12 U6.11
N$109
  Bottom 0.406: 3.13 U6.12
N$110
  Bottom 0.406: 3.14 U6.13
N$111
  Bottom 0.406: 3.15 U6.14
N$112
  Bottom 0.406: U6.15 49.53,10.16 3.16
N$113
  Top 0.254: U6.17 52.07,17.78 55.88,21.59 55.88,80.01 52.07,83.82 U8.26
N$115
  Bottom 0.254: R7.2 77.51,68.62 U7.20
N$116
  Bottom 0.406: U7.28 77.47,91.44 5.1
N$117
  Bottom 0.406: 5.2 U7.1
N$118
  Bottom 0.406: 5.3 U7.2
N$119
  Bottom 0.406: 5.4 U7.3
N$120
  Bottom 0.406: 5.5 U7.4
N$121
  Bottom 0.406: 5.6 U7.5
N$122
  Bottom 0.406: 5.7 U7.6
N$123
  Bottom 0.406: 5.8 U7.7
N$124
  Bottom 0.406: 5.9 U7.8
N$125
  Bottom 0.406: 5.10 U7.9
N$126
  Bottom 0.406: 5.11 U7.10
N$127
  Bottom 0.406: 5.12 U7.11
N$128
  Bottom 0.406: 5.13 U7.12
N$129
  Bottom 0.406: 5.14 U7.13
N$130
  Bottom 0.406: 5.15 U7.14
N$131
  Bottom 0.406: U7.15 77.47,53.34 5.16
N$132
  Top 0.406: U5.26 78.74,40.64 80.01,41.91 80.01,59.69 78.74,60.96 U7.17
N$134
  Bottom 0.406: U8.20 49.53,68.62 R8.2
N$135
  Bottom 0.406: U8.28 49.53,91.44 4.1
N$136
  Bottom 0.406: 4.2 U8.1
N$137
  Bottom 0.406: 4.3 U8.2
N$138
  Bottom 0.406: 4.4 U8.3
N$139
  Bottom 0.406: 4.5 U8.4
N$140
  Bottom 0.406: 4.6 U8.5
N$141
  Bottom 0.406: 4.7 U8.6
N$142
  Bottom 0.406: 4.8 U8.7
N$143
  Bottom 0.406: 4.9 U8.8
N$144
  Bottom 0.406: 4.10 U8.9
N$145
  Bottom 0.406: 4.11 U8.10
N$146
  Bottom 0.406: 4.12 U8.11
N$147
  Bottom 0.406: 4.13 U8.12
N$148
  Bottom 0.406: 4.14 U8.13
N$149
  Bottom 0.406: 4.15 U8.14
N$150
  Bottom 0.406: U8.15 49.53,53.34 4.16
N$151  (1 unrouted)
  Top 0.254: U7.26 74.93,83.82 73.66,85.09 73.66,91.44 71.12,93.98 55.88,93.98 53.34,91.44
  Bottom 0.254: U8.17 53.34,60.96
SCLK  (1 unrouted)
  Bottom 0.254: U2.25 22.86,81.28 24.13,80.01 46.99,80.01 | 46.99,80.01 74.93,80.01 | 74.93,80.01 102.87,80.01 104.14,81.28 U1.25 | U7.25 76.2,81.28 74.93,80.01 | U8.25 48.26,81.28 46.99,80.01 | U4.25 22.86,38.1 24.13,36.83 46.99,36.83 | 46.99,36.83 74.93,36.83 | 74.93,36.83 102.87,36.83 104.14,38.1 U3.25 | U5.25 76.2,38.1 74.93,36.83 | U6.25 48.26,38.1 46.99,36.83
VPRG  (1 unrouted)
  Bottom 0.254: U2.27 22.86,86.36 24.13,85.09 46.99,85.09 | 46.99,85.09 74.93,85.09 | 74.93,85.09 102.87,85.09 104.14,86.36 U1.27 | U7.27 76.2,86.36 74.93,85.09 | U8.27 48.26,86.36 46.99,85.09 | 46.99,41.91 74.93,41.91 | 74.93,41.91 102.87,41.91 104.14,43.18 U3.27 | U5.27 76.2,43.18 74.93,41.91 | U6.27 48.26,43.18 46.99,41.91 | 46.99,41.91 26.67,41.91 24.13,39.37 19.05,39.37 19.05,41.91 20.32,43.18 U4.27
XLAT  (1 unrouted)
  Bottom 0.254: U2.24 22.86,78.74 24.13,77.47 46.99,77.47 | 46.99,77.47 74.93,77.47 | 74.93,77.47 102.87,77.47 104.14,78.74 U1.24 | U7.24 76.2,78.74 74.93,77.47 | U8.24 48.26,78.74 46.99,77.47 | U4.24 22.86,35.56 24.13,34.29 46.99,34.29 | 46.99,34.29 74.93,34.29 | 74.93,34.29 102.87,34.29 104.14,35.56 U3.24 | U5.24 76.2,35.56 74.93,34.29 | U6.24 48.26,35.56 46.99,34.29